# Altium project Sayma_RTM.PrjPcb (part 4 of 11)

## Sheet PWR_SEPIC_P12V_N12V.SchDoc: Sayma RTM
size 420 x 297 mm; $$Internal___BlkDate: 23:43:25_12-13-18; $$Internal_NAME_PLACEHOLDER: a3sheet; $$Internal_Resolution: 00001mm; $$NotCommonProperty_@NAME: PWR_SEPIC_P12V_N12V; $$NotCommonProperty_@PRINTORDER: 6; $$NotCommonProperty_@SHEET: 1; $$NotCommonProperty_@SHEETTOTAL: 1; CmpIndex: 12; Drawing Author: G.Kasprowicz; Drawing Number: Sayma RTM; Drawing Project: 8 channel SAWG; Drawing Revision: 2.0; SymIndex: 2227; Author: G.Kasprowicz; CompanyName: WUT ISE; DrawnBy: G.Kasprowicz; Organization: WUT ISE; Address1: PW ISE; Address2: Nowowiejska 15/19 00-665 Warsaw; Address3: gkasprow@gmail.com; DocumentNumber: 16; Revision: 1.0; SheetNumber: 16; SheetTotal: 18; ModifiedBy: -; CheckedDate: -; Title2: +/- 12V SEPIC; DivGrp: WUT ISE; Designer: G.Kasprowicz; ModifiedDate: -; ProjectName: Sensor Box
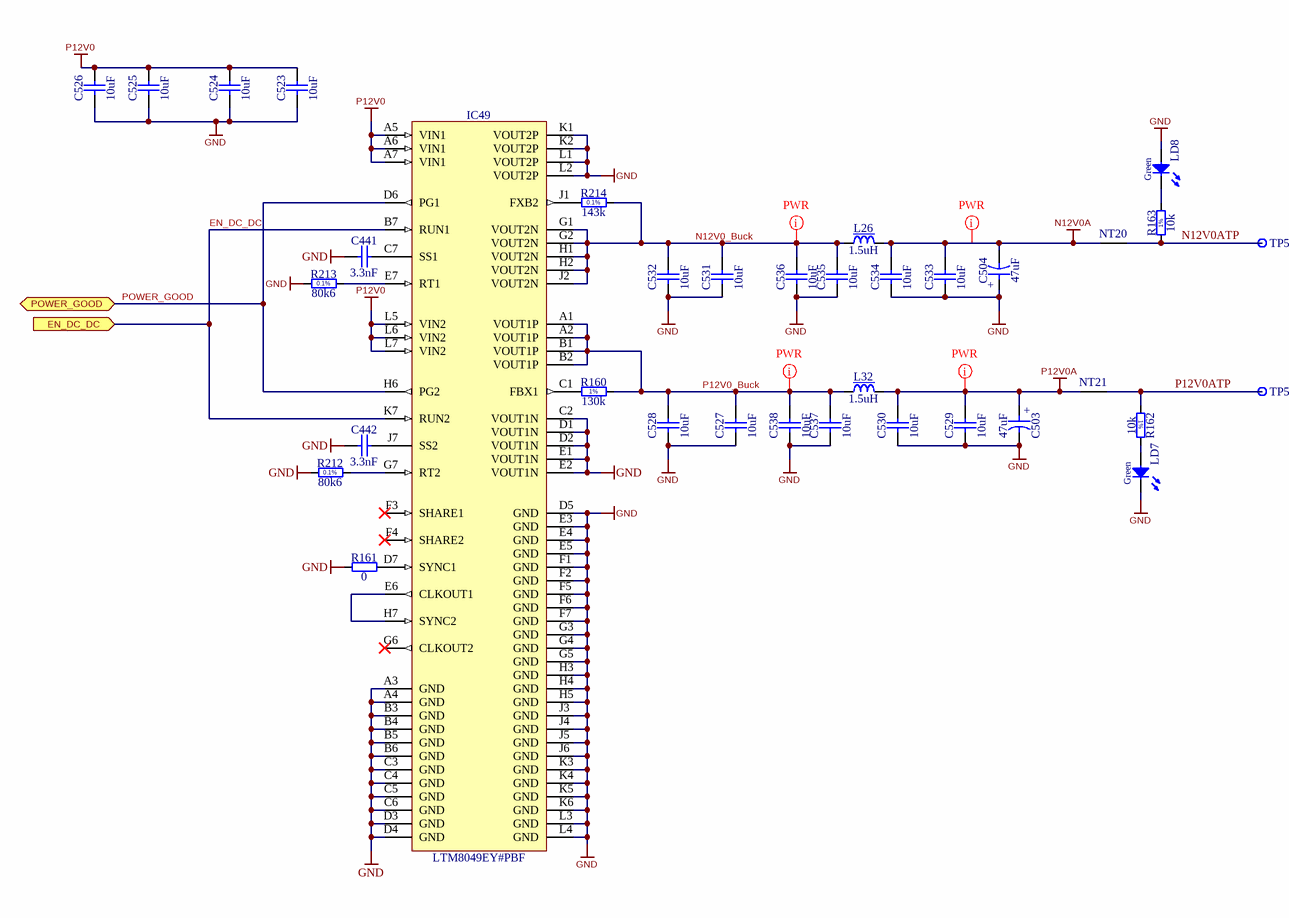
[diagram p5: PWR_SEPIC_P12V_N12V.SchDoc]

### Parts
C441  3.3nF  [CAPC1005X55N]
C442  3.3nF  [CAPC1005X55N]
C503  47uF  [CAPMP6032X280N]
C504  47uF  [CAPMP6032X280N]
C523  10uF  [CAPC2012X95N]
C524  10uF  [CAPC2012X95N]
C525  10uF  [CAPC2012X95N]
C526  10uF  [CAPC2012X95N]
C527  10uF  [CAPC2012X95N]
C528  10uF  [CAPC2012X95N]
C529  10uF  [CAPC2012X95N]
C530  10uF  [CAPC2012X95N]
C531  10uF  [CAPC2012X95N]
C532  10uF  [CAPC2012X95N]
C533  10uF  [CAPC2012X95N]
C534  10uF  [CAPC2012X95N]
C535  10uF  [CAPC2012X95N]
C536  10uF  [CAPC2012X95N]
C537  10uF  [CAPC2012X95N]
C538  10uF  [CAPC2012X95N]
IC49  LTM8049EY#PBF  [BGA77C127P7X11_900X1500X262]
L26  1.5uH  [IND_TDK_SPM6530]
L32  1.5uH  [IND_TDK_SPM6530]
LD7  Green  [LED_KINGBRIGHT_KPH-1608CGCK]
LD8  Green  [LED_KINGBRIGHT_KPH-1608CGCK]
NT20  Net Tie  [Net Tie]  (value not drawn)  (net tie, no BOM)
NT21  Net Tie  [Net Tie]  (value not drawn)  (net tie, no BOM)
R160  130k  [RESC1005X40N]
R161  0  [RESC1005X40N]
R162  10k  [RESC1005X40N]
R163  10k  [RESC1005X40N]
R212  80k6  [RESC1608X55N]
R213  80k6  [RESC1608X55N]
R214  143k  [RESC1608X55N]
TP55  Test Point  [TPS127]  (value not drawn)
TP56  Test Point  [TPS127]  (value not drawn)

### Ports
EN_DC_DC (in), POWER_GOOD (bidir)

### Nets
GND: C441.1 C442.1 C503.2 C504.1 C523.1 C524.1 C525.1 C526.1 C527.1 C528.1 C529.1 C530.1 C531.1 C532.1 C533.1 C534.1 C535.1 C536.1 C537.1 C538.1 IC49.A3(GND) IC49.A4(GND) IC49.B3(GND) IC49.B4(GND) IC49.B5(GND) IC49.B6(GND) IC49.C2(VOUT1N) IC49.C3(GND) IC49.C4(GND) IC49.C5(GND) IC49.C6(GND) IC49.D1(VOUT1N) IC49.D2(VOUT1N) IC49.D3(GND) IC49.D4(GND) IC49.D5(GND) IC49.E1(VOUT1N) IC49.E2(VOUT1N) IC49.E3(GND) IC49.E4(GND) IC49.E5(GND) IC49.F1(GND) IC49.F2(GND) IC49.F5(GND) IC49.F6(GND) IC49.F7(GND) IC49.G3(GND) IC49.G4(GND) IC49.G5(GND) IC49.H3(GND) IC49.H4(GND) IC49.H5(GND) IC49.J3(GND) IC49.J4(GND) IC49.J5(GND) IC49.J6(GND) IC49.K1(VOUT2P) IC49.K2(VOUT2P) IC49.K3(GND) IC49.K4(GND) IC49.K5(GND) IC49.K6(GND) IC49.L1(VOUT2P) IC49.L2(VOUT2P) IC49.L3(GND) IC49.L4(GND) LD7.1(C) LD8.2(A) R161.1 R212.1 R213.1
N12V0A: C504.2 C533.2 C534.2 L26.2 NT20.1
P12V0: C523.2 C524.2 C525.2 C526.2 IC49.A5(VIN1) IC49.A6(VIN1) IC49.A7(VIN1) IC49.L5(VIN2) IC49.L6(VIN2) IC49.L7(VIN2)
P12V0A: C503.1 C529.2 C530.2 L32.2 NT21.1
EN_DC_DC: IC49.B7(RUN1) IC49.K7(RUN2) ; port EN_DC_DC  [project net EN]
N12V0_Buck: C531.2 C532.2 C535.2 C536.2 IC49.G1(VOUT2N) IC49.G2(VOUT2N) IC49.H1(VOUT2N) IC49.H2(VOUT2N) IC49.J2(VOUT2N) L26.1 R214.2
N12V0ATP: NT20.2 R163.1 TP55.1
P12V0_Buck: C527.2 C528.2 C537.2 C538.2 IC49.A1(VOUT1P) IC49.A2(VOUT1P) IC49.B1(VOUT1P) IC49.B2(VOUT1P) L32.1 R160.2
P12V0ATP: NT21.2 R162.1 TP56.1
POWER_GOOD: IC49.D6(PG1) IC49.H6(PG2) ; port POWER_GOOD  [project net PGOOD]
NetC441_2: C441.2 IC49.C7(SS1)
NetC442_2: C442.2 IC49.J7(SS2)
NetIC49_C1: IC49.C1(FBX1) R160.1
NetIC49_D7: IC49.D7(SYNC1) R161.2
NetIC49_E6: IC49.E6(CLKOUT1) IC49.H7(SYNC2)
NetIC49_E7: IC49.E7(RT1) R213.2
NetIC49_G7: IC49.G7(RT2) R212.2
NetIC49_J1: IC49.J1(FXB2) R214.1
NetLD7_2: LD7.2(A) R162.2
NetLD8_1: LD8.1(C) R163.2

Not connected (* = marked no-connect by the designer): IC49 F3(SHARE1)* F4(SHARE2)* G6(CLKOUT2)*

### Layout directives
net class PWR: N12V0_Buck, N12V0A, P12V0_Buck, P12V0A

### Notes on the sheet
- Project/Equipment
- Document
- Designer
- Drawn by
- Check.by
- Copyright WUT ISE 2018.
  This documentation describes Open Hardware and is licensed under the CERN OHL v.1.1. You may redistribute and modify this documentation under the terms of the CERN OHL v.1.1. (http://ohwr.org/CERNOHL). This documentation is distributed WITHOUT ANY EXPRESS OR IMPLIED WARRANTY, INCLUDING OF MERCHANTABILITY, SATISFACTORY QUALITY AND FITNESS FOR A PARTICULAR PURPOSE. Please see the CERN OHL v.1.1 for applicable conditions.
- Contact
- File
- Last Mod.
- Print Date
- Sheet
- Size
- A3
- of
- Rev
- (in symbol CTE6032-28_47UF_16V_10%_LESR0350) +
- (in symbol R0402_10K_1%_0.0625W_100PPM) 1%
- (in symbol R0402_130K_1%_0.0625W_100PPM) 1%
- (in symbol R0603_80K6_0.1%_0.063W_10PPM) 0.1%
- (in symbol R0603_143K_0.1%_0.063W_10PPM) 0.1%

### Library data of the parts
C441 C442 = CC0402_3.3NF_50V_10%_X7R: Non-polarised capacitor; Manufacturer: GENERIC; Manufacturer1 Part Number: 223858715629; Part Description: SMD Multilayer Chip Ceramic Capacitor; TC: X7R; Tolerance: ±10%; Voltage: 50V; Case: 0402; Manufacturer Part Number: CC0402_3.3NF_50V_10%_X7R; Manufacturer1 Example: PHYCOMP; Part Number: CC0402_3.3NF_50V_10%_X7R; Pin Count: 2; SMD: Yes; Status: Not Recommended; Value: 3.3nF; Component Kind: Standard; Component Type: Standard; Mounted: Yes; Socket: No; Sense: No; Manufacturer1 ComponentHeight: 0.55mm; HelpURL: \\cern.ch\dfs\Applications\Altium\Datasheets\CC0402_X7R_PHYCOMP.pdf; Author: CERN DEM JLC; CreateDate: 03.12.2007; LatestRevisionDate: 03.12.2007
C503 C504 = CTE6032-28_47UF_16V_10%_LESR0350: as C488 on sheet DAC_JESD204B; Case: C; Manufacturer Part Number: CTE6032-28_47UF_16V_10%_LESR0350; Manufacturer1 Example: AVX; Part Number: CTE6032-28_47UF_16V_10%_LESR0350; Pin Count: 2; SMD: Yes; Value: 47uF; Component Kind: Standard; Component Type: Standard; Status: Preferred; Mounted: Yes; Socket: No; Sense: No; Manufacturer1 ComponentHeight: 2.8mm; HelpURL: \\cern.ch\dfs\Applications\Altium\Datasheets\CTE-LESR_AVX_TPS.pdf; Author: CERN DEM JLC; CreateDate: 05.05.2008; LatestRevisionDate: 20.01.2009
C523-C538 = CC0805_10UF_25V_10%_X5R: as C539 on sheet PWR_SEPIC_N6V; Case: 0805; Manufacturer Part Number: CC0805_10UF_25V_10%_X5R; Manufacturer1 Example: MURATA; Part Number: CC0805_10UF_25V_10%_X5R; Pin Count: 2; SMD: Yes; Status: Preferred; Value: 10uF; Component Kind: Standard; Component Type: Standard; Mounted: Yes; Socket: No; Sense: No; Manufacturer1 ComponentHeight: 0.95mm; HelpURL: \\cern.ch\dfs\Applications\Altium\Datasheets\CC0805_X5R_MURATA_GRM.pdf; Author: CERN DEM JLC; CreateDate: 25.10.2012; LatestRevisionDate: 06.09.2016
IC49 = LTM8049EY#PBF: as IC50 on sheet PWR_SEPIC_N6V; Part Number: LTM8049EY#PBF; Component Kind: Standard; Component Type: Standard; Device: LTM8049EY#PBF; PackageDescription: BGA, 1.27mm Pitch, Rect.; 77 Pin, 7 Columns X 11 Rows, 9.00mm X 15.00mm X 2.62mm H; Part Description: Dual SEPIC or Inverting uModule DC/DC Converter; Manufacturer Part Number: LTM8049EY#PBF; Pin Count: 77; Case: BGA77; Mounted: Yes; Socket: No; SMD: Yes; Sense: No; ComponentHeight: 2.62mm; HelpURL: \\cern.ch\dfs\Applications\Altium\Datasheets\LTM8049EY#PBF.pdf; Author: CERN DEM JLC; CreateDate: 08.12.2016; LatestRevisionDate: 08.12.2016
L26 L32 = IND_1.5UH_20%_TDK_SPM6530: as L25 on sheet PWR_SEPIC_N6V; ComponentHeight: 3mm; Part Number: IND_1.5UH_20%_TDK_SPM6530; Pin Count: 2; SMD: Yes; Value: 1.5uH; Component Kind: Standard; Component Type: Standard; Status: None; Mounted: Yes; Socket: No; Sense: No; HelpURL: \\cern.ch\dfs\Applications\Altium\Datasheets\IND_TDK_SPM6530.pdf; Author: CERN DEM MR; CreateDate: 08.11.2016; LatestRevisionDate: 08.11.2016
LD7 LD8 = LED_KINGBRIGHT_KPH-1608CGCK: as LD9 on sheet PWR_SEPIC_N6V; Author: CERN DEM JLC; Color: Green; Component Kind: Standard; Component Type: Standard; ComponentHeight: 0.65mm; CreateDate: 03.07.2017; HelpURL: \\cern.ch\dfs\Applications\Altium\Datasheets\LED_KINGBRIGHT_KPH-1608CGCK.pdf; LatestRevisionDate: 03.07.2017; Manufacturer Part Number: KPH-1608CGCK; Manufacturer: KINGBRIGHT; Mounted: Yes; PackageDescription: SMT Green LED, Case 0603, Body L 1.6 x W 0.8mm H 0.65mm; Part Number: LED_KINGBRIGHT_KPH-1608CGCK; Pin Count: 2; Sense: No; SMD: Yes; Socket: No
NT20 NT21 = Net Tie: as NT18 on sheet PWR_SEPIC_N6V; Part Number: Net Tie; Component Type: Net Tie; Pin Count: 2; Family: Net Tie; Socket: No; SMD: No; Sense: No; Status: None; ComponentHeight: 0mm; HelpURL: Undefined; Author: CERN DEM JLC; CreateDate: 22.03.2011; LatestRevisionDate: 22.03.2011; PackageDescription: 2 Plated Through Hole For Coaxial Cable Link: Hole Dia.=1.4mm Pad Dia.=2.5mm
R160 = R0402_130K_1%_0.0625W_100PPM: Resistor - 1%; Manufacturer: GENERIC; Manufacturer1 Part Number: 232270671304L; Part Description: General Purpose Thick Film Chip Resistor; TC: ±100ppm/°C; PressFit: No; Case: 0402; Manufacturer Part Number: R0402_130K_1%_0.0625W_100PPM; Manufacturer1 ComponentHeight: 0.4mm; Manufacturer1 Example: YAGEO PHYCOMP; Part Number: R0402_130K_1%_0.0625W_100PPM; Pin Count: 2; Power: 0.0625W; Sense: No; SMD: Yes; Status: Not Recommended; Tolerance: ±1%; Value: 130k; Component Kind: Standard; Component Type: Standard; Mounted: Yes; Socket: No; HelpURL: \\cern.ch\dfs\Applications\Altium\Datasheets\R0402_Phycomp_RC0402.pdf; Author: CERN DEM JLC; CreateDate: 03.12.2007; LatestRevisionDate: 17.10.2012
R161 = R0402_0R_JUMPER: as R30 on sheet DAC_JESD204B; Case: 0402; Manufacturer Part Number: R0402_0R_JUMPER; Manufacturer1 ComponentHeight: 0.4mm; Manufacturer1 Example: YAGEO PHYCOMP; Part Number: R0402_0R_JUMPER; Pin Count: 2; Sense: No; SMD: Yes; Status: Not Recommended; Value: 0; Component Kind: Standard; Component Type: Standard; Mounted: Yes; Socket: No; HelpURL: \\cern.ch\dfs\Applications\Altium\Datasheets\R0402_Phycomp_RC0402.pdf; Author: CERN DEM JLC; CreateDate: 03.12.2007; LatestRevisionDate: 17.10.2012
R162 R163 = R0402_10K_1%_0.0625W_100PPM: as R90 on sheet RTM_POWER_SUPPLY; Case: 0402; Manufacturer Part Number: R0402_10K_1%_0.0625W_100PPM; Manufacturer1 ComponentHeight: 0.4mm; Manufacturer1 Example: YAGEO PHYCOMP; Part Number: R0402_10K_1%_0.0625W_100PPM; Pin Count: 2; Power: 0.0625W; Sense: No; SMD: Yes; Status: Not Recommended; Tolerance: ±1%; Value: 10k; Component Kind: Standard; Component Type: Standard; Mounted: Yes; Socket: No; HelpURL: \\cern.ch\dfs\Applications\Altium\Datasheets\R0402_Phycomp_RC0402.pdf; Author: CERN DEM JLC; CreateDate: 03.12.2007; LatestRevisionDate: 17.10.2012
R212 R213 = R0603_80K6_0.1%_0.063W_10PPM: as R215 on sheet PWR_SEPIC_N6V; Case: 0603; Manufacturer Part Number: R0603_80K6_0.1%_0.063W_10PPM; Manufacturer1 ComponentHeight: 0.5mm; Manufacturer1 Example: TYCO HOLSWORTHY; Part Number: R0603_80K6_0.1%_0.063W_10PPM; Pin Count: 2; Sense: No; SMD: Yes; Status: Not Recommended; Tolerance: ±0.1%; Value: 80k6; Component Kind: Standard; Component Type: Standard; Mounted: Yes; Socket: No; HelpURL: \\cern.ch\dfs\Applications\Altium\Datasheets\R0603_Tyco_RN73.pdf; Author: CERN DEM JLC; CreateDate: 03.12.2007; LatestRevisionDate: 13.03.2008
R214 = R0603_143K_0.1%_0.063W_10PPM: Resistor - 0.1%; Manufacturer: GENERIC; Manufacturer1 Part Number: RN73C1J143KBTDF; Part Description: Thin Film Chip Resistor; Power: 0.063W; TC: ±10ppm; PressFit: No; Case: 0603; Manufacturer Part Number: R0603_143K_0.1%_0.063W_10PPM; Manufacturer1 ComponentHeight: 0.5mm; Manufacturer1 Example: TYCO HOLSWORTHY; Part Number: R0603_143K_0.1%_0.063W_10PPM; Pin Count: 2; Sense: No; SMD: Yes; Status: Not Recommended; Tolerance: ±0.1%; Value: 143k; Component Kind: Standard; Component Type: Standard; Mounted: Yes; Socket: No; HelpURL: \\cern.ch\dfs\Applications\Altium\Datasheets\R0603_Tyco_RN73.pdf; Author: CERN DEM JLC; CreateDate: 03.12.2007; LatestRevisionDate: 13.03.2008
TP55 TP56 = SMD_PAD_1.27X1.27MM: as TP63 on sheet DAC_JESD204B; ComponentHeight: 0mm; Family: Test Point; Part Number: SMD_PAD_1.27X1.27MM; Pin Count: 1; Sense: No; SMD: Yes; Socket: No; Status: None; Component Kind: Standard (No BOM); Component Type: Standard (No BOM); HelpURL: Undefined; Author: CERN DEM JLC; CreateDate: 12.01.2008; LatestRevisionDate: 12.01.2008; PackageDescription: 1.27mm x 1.27mm PCB Copper Area (SMD Test Point)

## Sheet PWR_Buck_2V_4V_4A.SchDoc: Sayma RTM
size 420 x 297 mm; $$Internal___BlkDate: 23:43:25_12-13-18; $$Internal_NAME_PLACEHOLDER: a3sheet; $$Internal_Resolution: 00001mm; $$NotCommonProperty_@NAME: PWR_Buck_2V_4V_4A; $$NotCommonProperty_@PRINTORDER: 3; $$NotCommonProperty_@SHEET: 1; $$NotCommonProperty_@SHEETTOTAL: 1; $$NotCommonProperty_FORWARD_PCB: 0; CmpIndex: 7; Drawing Author: G.Kasprowicz; Drawing Number: Sayma RTM; Drawing Project: 8 channel SAWG; Drawing Revision: 2.0; SymIndex: 2227; Author: G.Kasprowicz; CompanyName: WUT ISE; DrawnBy: G.Kasprowicz; Organization: WUT ISE; Address1: PW ISE; Address2: Nowowiejska 15/19 00-665 Warsaw; Address3: gkasprow@gmail.com; DocumentNumber: 12; Revision: 1.0; SheetNumber: 12; SheetTotal: 18; ModifiedBy: -; CheckedDate: -; Title2: +2V & +4V buck; DivGrp: WUT ISE; Designer: G.Kasprowicz; ModifiedDate: -; ProjectName: Sensor Box
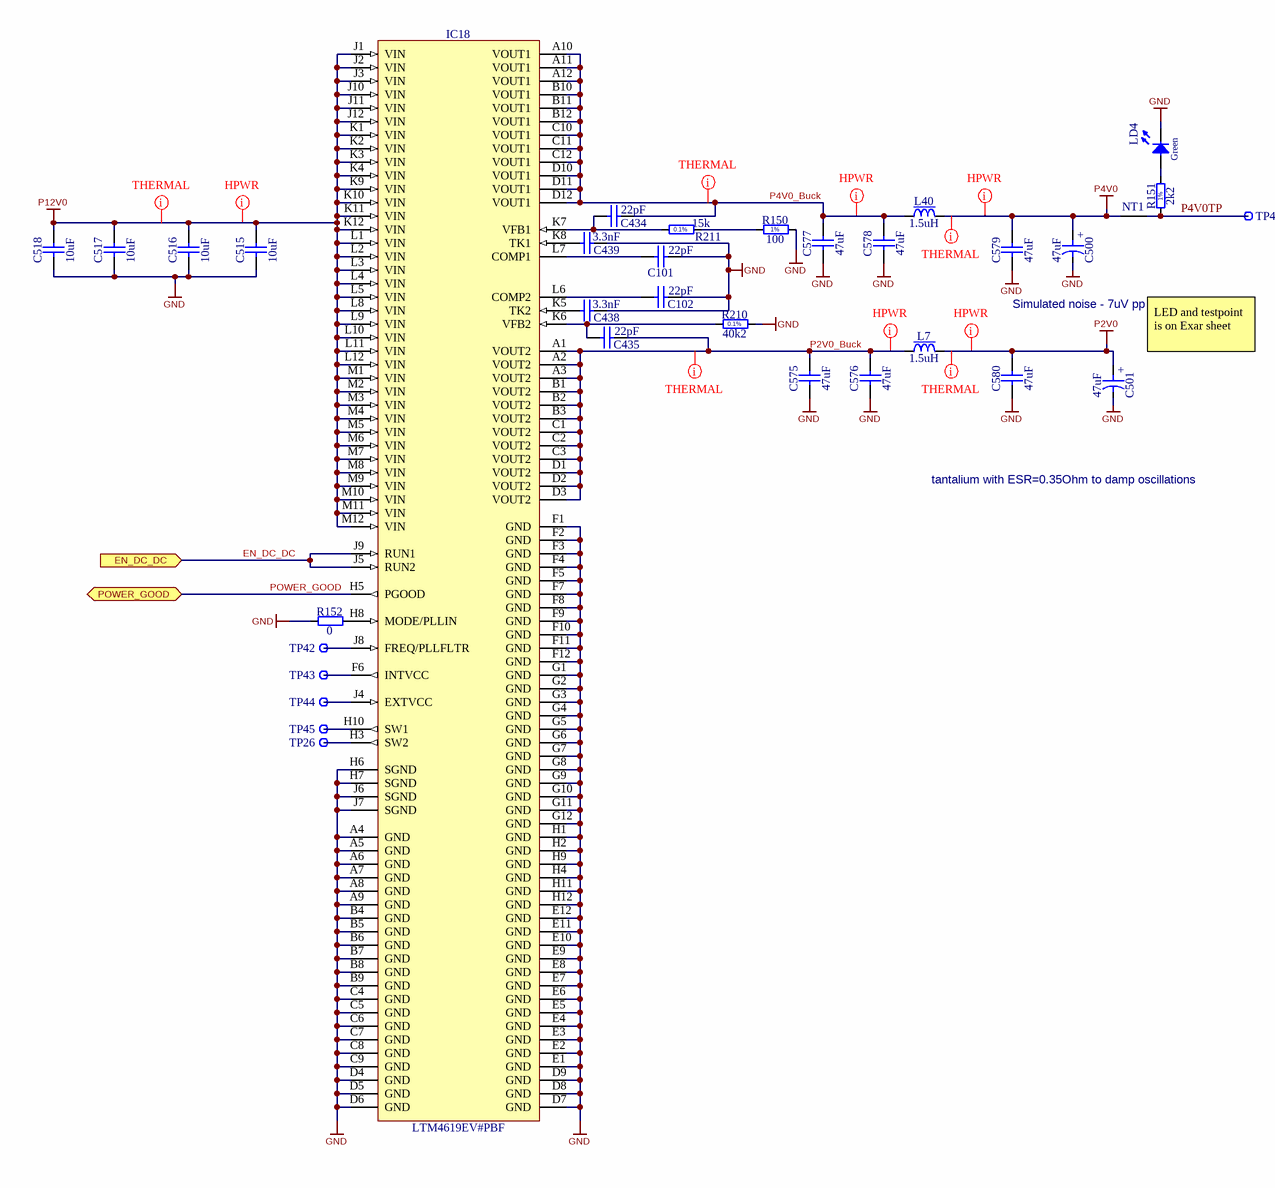
[diagram p6: PWR_Buck_2V_4V_4A.SchDoc]

### Parts
C101  22pF  [CAPC1005X55N]
C102  22pF  [CAPC1005X55N]
C434  22pF  [CAPC1005X55N]
C435  22pF  [CAPC1005X55N]
C438  3.3nF  [CAPC1005X55N]
C439  3.3nF  [CAPC1005X55N]
C500  47uF  [CAPMP6032X280N]
C501  47uF  [CAPMP6032X280N]
C515  10uF  [CAPC2012X95N]
C516  10uF  [CAPC2012X95N]
C517  10uF  [CAPC2012X95N]
C518  10uF  [CAPC2012X95N]
C575  47uF  [CAPC3225X270N]
C576  47uF  [CAPC3225X270N]
C577  47uF  [CAPC3225X270N]
C578  47uF  [CAPC3225X270N]
C579  47uF  [CAPC3225X270N]
C580  47uF  [CAPC3225X270N]
IC18  LTM4619EV#PBF  [LGA144S127P12X12_1500X1500X292R]
L7  1.5uH  [IND_TDK_SPM6530]
L40  1.5uH  [IND_TDK_SPM6530]
LD4  Green  [LED_KINGBRIGHT_KPH-1608CGCK]
NT1  Net Tie  [Net Tie]  (value not drawn)  (net tie, no BOM)
R150  100  [RESC1005X40N]
R151  2k2  [RESC1005X40N]
R152  0  [RESC1005X40N]
R210  40k2  [RESC1608X55N]
R211  15k  [RESC1608X55N]
TP26  Test Point  [TPS127]  (value not drawn)
TP41  Test Point  [TPS127]  (value not drawn)
TP42  Test Point  [TPS127]  (value not drawn)
TP43  Test Point  [TPS127]  (value not drawn)
TP44  Test Point  [TPS127]  (value not drawn)
TP45  Test Point  [TPS127]  (value not drawn)

### Ports
EN_DC_DC (in), POWER_GOOD (bidir)

### Nets
GND: C101.1 C102.1 C438.2 C439.2 C500.2 C501.2 C515.1 C516.1 C517.1 C518.1 C575.1 C576.1 C577.1 C578.1 C579.1 C580.1 IC18.A4(GND) IC18.A5(GND) IC18.A6(GND) IC18.A7(GND) IC18.A8(GND) IC18.A9(GND) IC18.B4(GND) IC18.B5(GND) IC18.B6(GND) IC18.B7(GND) IC18.B8(GND) IC18.B9(GND) IC18.C4(GND) IC18.C5(GND) IC18.C6(GND) IC18.C7(GND) IC18.C8(GND) IC18.C9(GND) IC18.D4(GND) IC18.D5(GND) IC18.D6(GND) IC18.D7(GND) IC18.D8(GND) IC18.D9(GND) IC18.E1(GND) IC18.E2(GND) IC18.E3(GND) IC18.E4(GND) IC18.E5(GND) IC18.E6(GND) IC18.E7(GND) IC18.E8(GND) IC18.E9(GND) IC18.E10(GND) IC18.E11(GND) IC18.E12(GND) IC18.F1(GND) IC18.F2(GND) IC18.F3(GND) IC18.F4(GND) IC18.F5(GND) IC18.F7(GND) IC18.F8(GND) IC18.F9(GND) IC18.F10(GND) IC18.F11(GND) IC18.F12(GND) IC18.G1(GND) IC18.G2(GND) IC18.G3(GND) IC18.G4(GND) IC18.G5(GND) IC18.G6(GND) IC18.G7(GND) IC18.G8(GND) IC18.G9(GND) IC18.G10(GND) IC18.G11(GND) IC18.G12(GND) IC18.H1(GND) IC18.H2(GND) IC18.H4(GND) IC18.H6(SGND) IC18.H7(SGND) IC18.H9(GND) IC18.H11(GND) IC18.H12(GND) IC18.J6(SGND) IC18.J7(SGND) LD4.1(C) R150.2 R152.1 R210.2
P2V0: C501.1 C580.2 L7.2
P4V0: C500.1 C579.2 L40.2 NT1.1
P12V0: C515.2 C516.2 C517.2 C518.2 IC18.J1(VIN) IC18.J2(VIN) IC18.J3(VIN) IC18.J10(VIN) IC18.J11(VIN) IC18.J12(VIN) IC18.K1(VIN) IC18.K2(VIN) IC18.K3(VIN) IC18.K4(VIN) IC18.K9(VIN) IC18.K10(VIN) IC18.K11(VIN) IC18.K12(VIN) IC18.L1(VIN) IC18.L2(VIN) IC18.L3(VIN) IC18.L4(VIN) IC18.L5(VIN) IC18.L8(VIN) IC18.L9(VIN) IC18.L10(VIN) IC18.L11(VIN) IC18.L12(VIN) IC18.M1(VIN) IC18.M2(VIN) IC18.M3(VIN) IC18.M4(VIN) IC18.M5(VIN) IC18.M6(VIN) IC18.M7(VIN) IC18.M8(VIN) IC18.M9(VIN) IC18.M10(VIN) IC18.M11(VIN) IC18.M12(VIN)
EN_DC_DC: IC18.J5(RUN2) IC18.J9(RUN1) ; port EN_DC_DC  [project net EN]
P2V0_Buck: C435.1 C575.2 C576.2 IC18.A1(VOUT2) IC18.A2(VOUT2) IC18.A3(VOUT2) IC18.B1(VOUT2) IC18.B2(VOUT2) IC18.B3(VOUT2) IC18.C1(VOUT2) IC18.C2(VOUT2) IC18.C3(VOUT2) IC18.D1(VOUT2) IC18.D2(VOUT2) IC18.D3(VOUT2) L7.1
P4V0_Buck: C434.1 C577.2 C578.2 IC18.A10(VOUT1) IC18.A11(VOUT1) IC18.A12(VOUT1) IC18.B10(VOUT1) IC18.B11(VOUT1) IC18.B12(VOUT1) IC18.C10(VOUT1) IC18.C11(VOUT1) IC18.C12(VOUT1) IC18.D10(VOUT1) IC18.D11(VOUT1) IC18.D12(VOUT1) L40.1
P4V0TP: NT1.2 R151.1 TP41.1
POWER_GOOD: IC18.H5(PGOOD) ; port POWER_GOOD  [project net PGOOD]
NetC101_2: C101.2 IC18.L7(COMP1)
NetC102_2: C102.2 IC18.L6(COMP2)
NetC434_2: C434.2 IC18.K7(VFB1) R211.1
NetC435_2: C435.2 IC18.K6(VFB2) R210.1
NetC438_1: C438.1 IC18.K5(TK2)
NetC439_1: C439.1 IC18.K8(TK1)
NetIC18_F6: IC18.F6(INTVCC) TP43.1
NetIC18_H3: IC18.H3(SW2) TP26.1
NetIC18_H8: IC18.H8(MODE/PLLIN) R152.2
NetIC18_H10: IC18.H10(SW1) TP45.1
NetIC18_J4: IC18.J4(EXTVCC) TP44.1
NetIC18_J8: IC18.J8(FREQ/PLLFLTR) TP42.1
NetLD4_2: LD4.2(A) R151.2
NetR150_1: R150.1 R211.2

### Layout directives
net class HPWR: P2V0, P2V0_Buck, P4V0, P4V0_Buck, P12V0
net class THERMAL: P2V0, P2V0_Buck, P4V0, P4V0_Buck, P12V0

### Notes on the sheet
- Simulated noise - 7uV pp
- (near C501) LED and testpoint is on Exar sheet
- tantalium with ESR=0.35Ohm to damp oscillations
- Project/Equipment
- Document
- Designer
- Drawn by
- Check.by
- Copyright WUT ISE 2018.
  This documentation describes Open Hardware and is licensed under the CERN OHL v.1.1. You may redistribute and modify this documentation under the terms of the CERN OHL v.1.1. (http://ohwr.org/CERNOHL). This documentation is distributed WITHOUT ANY EXPRESS OR IMPLIED WARRANTY, INCLUDING OF MERCHANTABILITY, SATISFACTORY QUALITY AND FITNESS FOR A PARTICULAR PURPOSE. Please see the CERN OHL v.1.1 for applicable conditions.
- Contact
- File
- Last Mod.
- Print Date
- Sheet
- Size
- A3
- of
- Rev
- (in symbol CTE6032-28_47UF_16V_10%_LESR0350) +
- (in symbol R0402_2K2_1%_0.0625W_100PPM) 1%
- (in symbol R0402_100R_1%_0.0625W_100PPM) 1%
- (in symbol R0603_15K_0.1%_0.063W_10PPM) 0.1%
- (in symbol R0603_40K2_0.1%_0.063W_10PPM) 0.1%

### Library data of the parts
C101 C102 C434 C435 = CC0402_22PF_50V_5%_C0G: Non-polarised capacitor; Manufacturer: GENERIC; Manufacturer1 Part Number: C0402C220J5GACTU; Part Description: SMD Multilayer Chip Ceramic Capacitor; TC: C0G/NP0; Tolerance: ±5%; Voltage: 50V; Case: 0402; Manufacturer Part Number: CC0402_22PF_50V_5%_C0G; Manufacturer1 Example: KEMET; Part Number: CC0402_22PF_50V_5%_C0G; Pin Count: 2; SMD: Yes; Status: Preferred; Value: 22pF; Component Kind: Standard; Component Type: Standard; Mounted: Yes; Socket: No; Sense: No; Manufacturer1 ComponentHeight: 0.55mm; HelpURL: \\cern.ch\dfs\Applications\Altium\Datasheets\CC0805_C0G_KEMET_(Commercial Grade).pdf; Author: CERN DEM JLC; CreateDate: 03.12.2007; LatestRevisionDate: 03.12.2007
C438 C439 = CC0402_3.3NF_50V_10%_X7R: as C441 on sheet PWR_SEPIC_P12V_N12V; Case: 0402; Manufacturer Part Number: CC0402_3.3NF_50V_10%_X7R; Manufacturer1 Example: PHYCOMP; Part Number: CC0402_3.3NF_50V_10%_X7R; Pin Count: 2; SMD: Yes; Status: Not Recommended; Value: 3.3nF; Component Kind: Standard; Component Type: Standard; Mounted: Yes; Socket: No; Sense: No; Manufacturer1 ComponentHeight: 0.55mm; HelpURL: \\cern.ch\dfs\Applications\Altium\Datasheets\CC0402_X7R_PHYCOMP.pdf; Author: CERN DEM JLC; CreateDate: 03.12.2007; LatestRevisionDate: 03.12.2007
C500 C501 = CTE6032-28_47UF_16V_10%_LESR0350: as C488 on sheet DAC_JESD204B; Case: C; Manufacturer Part Number: CTE6032-28_47UF_16V_10%_LESR0350; Manufacturer1 Example: AVX; Part Number: CTE6032-28_47UF_16V_10%_LESR0350; Pin Count: 2; SMD: Yes; Value: 47uF; Component Kind: Standard; Component Type: Standard; Status: Preferred; Mounted: Yes; Socket: No; Sense: No; Manufacturer1 ComponentHeight: 2.8mm; HelpURL: \\cern.ch\dfs\Applications\Altium\Datasheets\CTE-LESR_AVX_TPS.pdf; Author: CERN DEM JLC; CreateDate: 05.05.2008; LatestRevisionDate: 20.01.2009
C515-C518 = CC0805_10UF_25V_10%_X5R: as C539 on sheet PWR_SEPIC_N6V; Case: 0805; Manufacturer Part Number: CC0805_10UF_25V_10%_X5R; Manufacturer1 Example: MURATA; Part Number: CC0805_10UF_25V_10%_X5R; Pin Count: 2; SMD: Yes; Status: Preferred; Value: 10uF; Component Kind: Standard; Component Type: Standard; Mounted: Yes; Socket: No; Sense: No; Manufacturer1 ComponentHeight: 0.95mm; HelpURL: \\cern.ch\dfs\Applications\Altium\Datasheets\CC0805_X5R_MURATA_GRM.pdf; Author: CERN DEM JLC; CreateDate: 25.10.2012; LatestRevisionDate: 06.09.2016
C575-C580 = CC1210_47UF_10V_10%_X7R: as C584 on sheet PWR_SEPIC_N6V; Case: 1210; Manufacturer Part Number: CC1210_47UF_10V_10%_X7R; Manufacturer1 Example: MURATA; Part Number: CC1210_47UF_10V_10%_X7R; Pin Count: 2; SMD: Yes; Status: None; Value: 47uF; Component Kind: Standard; Component Type: Standard; Mounted: Yes; Socket: No; Sense: No; Manufacturer1 ComponentHeight: 2.7mm; HelpURL: \\cern.ch\dfs\Applications\Altium\Datasheets\CC1210_X7R_MURATA.pdf; Author: CERN DEM BC; CreateDate: 18.11.2015; LatestRevisionDate: 18.11.2015
IC18 = LTM4619EV#PBF: 4.5V-26.5V To 0.8V-5V, Iout 4A Dual DC/DC uModule Regulator; Manufacturer: LINEAR TECHNOLOGY; Part Description: 4.5V-26.5V To 0.8V-5V, Iout 4A Dual DC-DC uModule Regulator; Bonding: No; PressFit: No; Case: LGA144; ComponentHeight: 2.92mm; Device: LTM4619EV#PBF; Manufacturer Part Number: LTM4619EV#PBF; Mounted: Yes; PackageDescription: LGA,1.27mm pitch,square;144 pin,12 columns X 12 rows,15.00mm X 15.00mm X 2.92mm H (w/reversed pins); Part Number: LTM4619EV#PBF; Pin Count: 144; Sense: No; SMD: Yes; Socket: No; Component Kind: Standard; Component Type: Standard; HelpURL: \\cern.ch\dfs\Applications\Altium\Datasheets\LTM4619EV#PBF.pdf; Author: CERN DEM JLC; CreateDate: 06.05.2010; LatestRevisionDate: 07.12.2011
L7 L40 = IND_1.5UH_20%_TDK_SPM6530: as L25 on sheet PWR_SEPIC_N6V; ComponentHeight: 3mm; Part Number: IND_1.5UH_20%_TDK_SPM6530; Pin Count: 2; SMD: Yes; Value: 1.5uH; Component Kind: Standard; Component Type: Standard; Status: None; Mounted: Yes; Socket: No; Sense: No; HelpURL: \\cern.ch\dfs\Applications\Altium\Datasheets\IND_TDK_SPM6530.pdf; Author: CERN DEM MR; CreateDate: 08.11.2016; LatestRevisionDate: 08.11.2016
LD4 = LED_KINGBRIGHT_KPH-1608CGCK: as LD9 on sheet PWR_SEPIC_N6V; Author: CERN DEM JLC; Color: Green; Component Kind: Standard; Component Type: Standard; ComponentHeight: 0.65mm; CreateDate: 03.07.2017; HelpURL: \\cern.ch\dfs\Applications\Altium\Datasheets\LED_KINGBRIGHT_KPH-1608CGCK.pdf; LatestRevisionDate: 03.07.2017; Manufacturer Part Number: KPH-1608CGCK; Manufacturer: KINGBRIGHT; Mounted: Yes; PackageDescription: SMT Green LED, Case 0603, Body L 1.6 x W 0.8mm H 0.65mm; Part Number: LED_KINGBRIGHT_KPH-1608CGCK; Pin Count: 2; Sense: No; SMD: Yes; Socket: No
NT1 = Net Tie: as NT18 on sheet PWR_SEPIC_N6V; Part Number: Net Tie; Component Type: Net Tie; Pin Count: 2; Family: Net Tie; Socket: No; SMD: No; Sense: No; Status: None; ComponentHeight: 0mm; HelpURL: Undefined; Author: CERN DEM JLC; CreateDate: 22.03.2011; LatestRevisionDate: 22.03.2011; PackageDescription: 2 Plated Through Hole For Coaxial Cable Link: Hole Dia.=1.4mm Pad Dia.=2.5mm
R150 = R0402_100R_1%_0.0625W_100PPM: Resistor - 1%; Manufacturer: GENERIC; Manufacturer1 Part Number: 232270671001L; Part Description: General Purpose Thick Film Chip Resistor; TC: ±100ppm/°C; PressFit: No; Case: 0402; Manufacturer Part Number: R0402_100R_1%_0.0625W_100PPM; Manufacturer1 ComponentHeight: 0.4mm; Manufacturer1 Example: YAGEO PHYCOMP; Part Number: R0402_100R_1%_0.0625W_100PPM; Pin Count: 2; Power: 0.0625W; Sense: No; SMD: Yes; Status: Not Recommended; Tolerance: ±1%; Value: 100; Component Kind: Standard; Component Type: Standard; Mounted: Yes; Socket: No; HelpURL: \\cern.ch\dfs\Applications\Altium\Datasheets\R0402_Phycomp_RC0402.pdf; Author: CERN DEM JLC; CreateDate: 03.12.2007; LatestRevisionDate: 17.10.2012
R151 = R0402_2K2_1%_0.0625W_100PPM: Resistor - 1%; Manufacturer: GENERIC; Manufacturer1 Part Number: 232270672202L; Part Description: General Purpose Thick Film Chip Resistor; TC: ±100ppm/°C; PressFit: No; Case: 0402; Manufacturer Part Number: R0402_2K2_1%_0.0625W_100PPM; Manufacturer1 ComponentHeight: 0.4mm; Manufacturer1 Example: YAGEO PHYCOMP; Part Number: R0402_2K2_1%_0.0625W_100PPM; Pin Count: 2; Power: 0.0625W; Sense: No; SMD: Yes; Status: Not Recommended; Tolerance: ±1%; Value: 2k2; Component Kind: Standard; Component Type: Standard; Mounted: Yes; Socket: No; HelpURL: \\cern.ch\dfs\Applications\Altium\Datasheets\R0402_Phycomp_RC0402.pdf; Author: CERN DEM JLC; CreateDate: 03.12.2007; LatestRevisionDate: 17.10.2012
R152 = R0402_0R_JUMPER: as R30 on sheet DAC_JESD204B; Case: 0402; Manufacturer Part Number: R0402_0R_JUMPER; Manufacturer1 ComponentHeight: 0.4mm; Manufacturer1 Example: YAGEO PHYCOMP; Part Number: R0402_0R_JUMPER; Pin Count: 2; Sense: No; SMD: Yes; Status: Not Recommended; Value: 0; Component Kind: Standard; Component Type: Standard; Mounted: Yes; Socket: No; HelpURL: \\cern.ch\dfs\Applications\Altium\Datasheets\R0402_Phycomp_RC0402.pdf; Author: CERN DEM JLC; CreateDate: 03.12.2007; LatestRevisionDate: 17.10.2012
R210 = R0603_40K2_0.1%_0.063W_10PPM: Resistor - 0.1%; Manufacturer: GENERIC; Manufacturer1 Part Number: RN73C1J40K2BTDF; Part Description: Thin Film Chip Resistor; Power: 0.063W; TC: ±10ppm; PressFit: No; Case: 0603; Manufacturer Part Number: R0603_40K2_0.1%_0.063W_10PPM; Manufacturer1 ComponentHeight: 0.5mm; Manufacturer1 Example: TYCO HOLSWORTHY; Part Number: R0603_40K2_0.1%_0.063W_10PPM; Pin Count: 2; Sense: No; SMD: Yes; Status: Not Recommended; Tolerance: ±0.1%; Value: 40k2; Component Kind: Standard; Component Type: Standard; Mounted: Yes; Socket: No; HelpURL: \\cern.ch\dfs\Applications\Altium\Datasheets\R0603_Tyco_RN73.pdf; Author: CERN DEM JLC; CreateDate: 03.12.2007; LatestRevisionDate: 13.03.2008
R211 = R0603_15K_0.1%_0.063W_10PPM: Resistor - 0.1%; Manufacturer: GENERIC; Manufacturer1 Part Number: RN73C1J15KBTDF; Part Description: Thin Film Chip Resistor; Power: 0.063W; TC: ±10ppm; PressFit: No; Case: 0603; Manufacturer Part Number: R0603_15K_0.1%_0.063W_10PPM; Manufacturer1 ComponentHeight: 0.5mm; Manufacturer1 Example: TYCO HOLSWORTHY; Part Number: R0603_15K_0.1%_0.063W_10PPM; Pin Count: 2; Sense: No; SMD: Yes; Status: Not Recommended; Tolerance: ±0.1%; Value: 15k; Component Kind: Standard; Component Type: Standard; Mounted: Yes; Socket: No; HelpURL: \\cern.ch\dfs\Applications\Altium\Datasheets\R0603_Tyco_RN73.pdf; Author: CERN DEM JLC; CreateDate: 03.12.2007; LatestRevisionDate: 13.03.2008
TP26 TP41-TP45 = SMD_PAD_1.27X1.27MM: as TP63 on sheet DAC_JESD204B; ComponentHeight: 0mm; Family: Test Point; Part Number: SMD_PAD_1.27X1.27MM; Pin Count: 1; Sense: No; SMD: Yes; Socket: No; Status: None; Component Kind: Standard (No BOM); Component Type: Standard (No BOM); HelpURL: Undefined; Author: CERN DEM JLC; CreateDate: 12.01.2008; LatestRevisionDate: 12.01.2008; PackageDescription: 1.27mm x 1.27mm PCB Copper Area (SMD Test Point)

## Sheet PWR_Buck_6V_8A.SchDoc: Sayma RTM
size 420 x 297 mm; $$Internal___BlkDate: 23:43:25_12-13-18; $$Internal_NAME_PLACEHOLDER: a3sheet; $$Internal_Resolution: 00001mm; $$NotCommonProperty_@NAME: PWR_Buck_6V_8A; $$NotCommonProperty_@PRINTORDER: 4; $$NotCommonProperty_@SHEET: 1; $$NotCommonProperty_@SHEETTOTAL: 1; $$NotCommonProperty_FORWARD_PCB: 0; CmpIndex: 6; Drawing Author: G.Kasprowicz; Drawing Number: Sayma RTM; Drawing Project: 8 channel SAWG; Drawing Revision: 2.0; SymIndex: 2227; Author: G.Kasprowicz; CompanyName: WUT ISE; DrawnBy: G.Kasprowicz; Organization: WUT ISE; Address1: PW ISE; Address2: Nowowiejska 15/19 00-665 Warsaw; Address3: gkasprow@gmail.com; DocumentNumber: 13; Revision: 1.0; SheetNumber: 13; SheetTotal: 18; ModifiedBy: -; CheckedDate: -; Title2: +6V buck; DivGrp: WUT ISE; Designer: G.Kasprowicz; ModifiedDate: -; ProjectName: Sensor Box
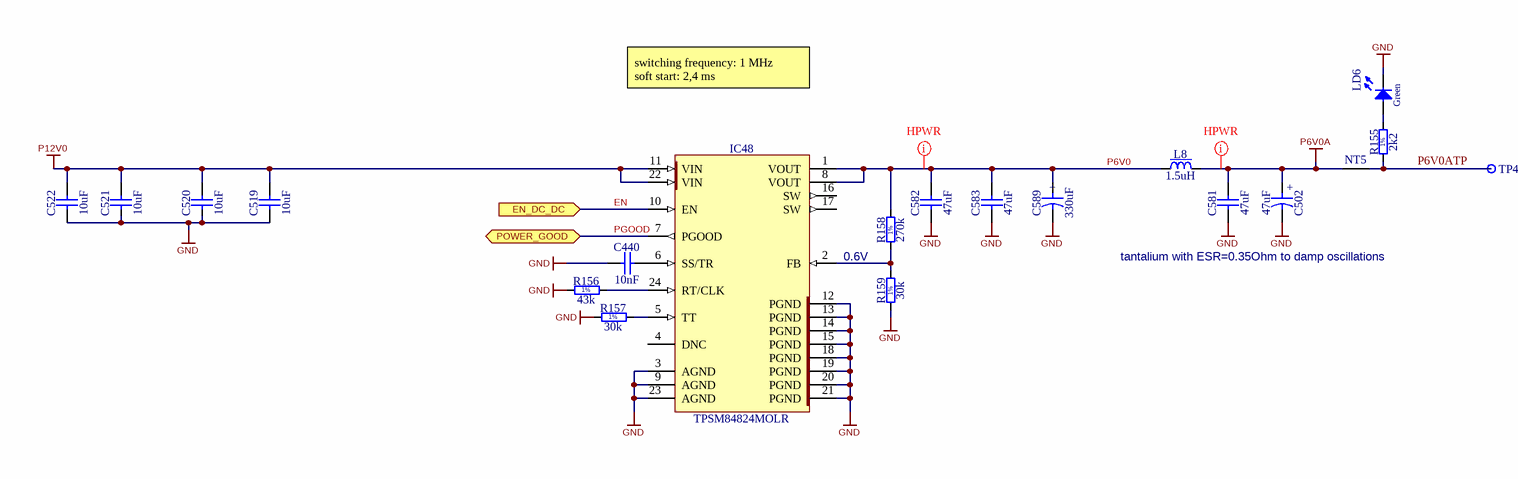
[diagram p7: PWR_Buck_6V_8A.SchDoc]

### Parts
C440  10nF  [CAPC1005X55N]
C502  47uF  [CAPMP6032X280N]
C519  10uF  [CAPC2012X95N]
C520  10uF  [CAPC2012X95N]
C521  10uF  [CAPC2012X95N]
C522  10uF  [CAPC2012X95N]
C581  47uF  [CAPC3225X270N]
C582  47uF  [CAPC3225X270N]
C583  47uF  [CAPC3225X270N]
C589  330uF  [CAPMP7343X310N]
IC48  TPSM84824MOLR  [TEXAS_QFM (MOL)]
L8  1.5uH  [IND_TDK_SPM6530]
LD6  Green  [LED_KINGBRIGHT_KPH-1608CGCK]
NT5  Net Tie  [Net Tie]  (value not drawn)  (net tie, no BOM)
R155  2k2  [RESC1005X40N]
R156  43k  [RESC1005X40N]
R157  30k  [RESC1005X40N]
R158  270k  [RESC1005X40N]
R159  30k  [RESC1005X40N]
TP48  Test Point  [TPS127]  (value not drawn)

### Ports
EN_DC_DC (in), POWER_GOOD (bidir)

### Nets
GND: C440.1 C502.2 C519.1 C520.1 C521.1 C522.1 C581.1 C582.1 C583.1 C589.2 IC48.3(AGND) IC48.9(AGND) IC48.12(PGND) IC48.13(PGND) IC48.14(PGND) IC48.15(PGND) IC48.18(PGND) IC48.19(PGND) IC48.20(PGND) IC48.21(PGND) IC48.23(AGND) LD6.1(C) R156.1 R157.1 R159.1
P6V0A: C502.1 C581.2 L8.2 NT5.1
P12V0: C519.2 C520.2 C521.2 C522.2 IC48.11(VIN) IC48.22(VIN)
EN: IC48.10(EN) ; port EN_DC_DC
P6V0: C582.2 C583.2 C589.1 IC48.1(VOUT) IC48.8(VOUT) L8.1 R158.2
P6V0ATP: NT5.2 R155.1 TP48.1
PGOOD: IC48.7(PGOOD) ; port POWER_GOOD
NetC440_2: C440.2 IC48.6(SS/TR)
NetIC48_2: IC48.2(FB) R158.1 R159.2
NetIC48_5: IC48.5(TT) R157.2
NetIC48_24: IC48.24(RT/CLK) R156.2
NetLD6_2: LD6.2(A) R155.2

Not connected (* = marked no-connect by the designer): IC48 4(DNC) 16(SW) 17(SW)

### Layout directives
net class HPWR: P6V0, P6V0A

### Notes on the sheet
- switching frequency: 1 MHz
  soft start: 2,4 ms
- 0.6V
- tantalium with ESR=0.35Ohm to damp oscillations
- Project/Equipment
- Document
- Designer
- Drawn by
- Check.by
- Copyright WUT ISE 2018.
  This documentation describes Open Hardware and is licensed under the CERN OHL v.1.1. You may redistribute and modify this documentation under the terms of the CERN OHL v.1.1. (http://ohwr.org/CERNOHL). This documentation is distributed WITHOUT ANY EXPRESS OR IMPLIED WARRANTY, INCLUDING OF MERCHANTABILITY, SATISFACTORY QUALITY AND FITNESS FOR A PARTICULAR PURPOSE. Please see the CERN OHL v.1.1 for applicable conditions.
- Contact
- File
- Last Mod.
- Print Date
- Sheet
- Size
- A3
- of
- Rev
- (in symbol CTE6032-28_47UF_16V_10%_LESR0350) +
- (in symbol CTE7343-31_330UF_6.3V_20%_LESR0015_KEMET_T520) +
- (in symbol R0402_2K2_1%_0.0625W_100PPM) 1%
- (in symbol R0402_30K_1%_0.0625W_100PPM) 1%
- (in symbol R0402_30k_1%_0.0625W_100PPM) 1%
- (in symbol R0402_43K_1%_0.0625W_100PPM) 1%
- (in symbol R0402_270K_1%_0.0625W_100PPM) 1%

### Library data of the parts
C440 = CC0402_10NF_16V_10%_X7R: Non-polarised capacitor; Manufacturer: GENERIC; Manufacturer1 Part Number: 223878715636; Part Description: SMD Multilayer Chip Ceramic Capacitor; TC: X7R; Tolerance: ±10%; Voltage: 16V; Case: 0402; Manufacturer Part Number: CC0402_10NF_16V_10%_X7R; Manufacturer1 Example: PHYCOMP; Part Number: CC0402_10NF_16V_10%_X7R; Pin Count: 2; SMD: Yes; Status: Not Recommended; Value: 10nF; Component Kind: Standard; Component Type: Standard; Mounted: Yes; Socket: No; Sense: No; Manufacturer1 ComponentHeight: 0.55mm; HelpURL: \\cern.ch\dfs\Applications\Altium\Datasheets\CC0402_X7R_PHYCOMP.pdf; Author: CERN DEM JLC; CreateDate: 03.12.2007; LatestRevisionDate: 03.12.2007
C502 = CTE6032-28_47UF_16V_10%_LESR0350: as C488 on sheet DAC_JESD204B; Case: C; Manufacturer Part Number: CTE6032-28_47UF_16V_10%_LESR0350; Manufacturer1 Example: AVX; Part Number: CTE6032-28_47UF_16V_10%_LESR0350; Pin Count: 2; SMD: Yes; Value: 47uF; Component Kind: Standard; Component Type: Standard; Status: Preferred; Mounted: Yes; Socket: No; Sense: No; Manufacturer1 ComponentHeight: 2.8mm; HelpURL: \\cern.ch\dfs\Applications\Altium\Datasheets\CTE-LESR_AVX_TPS.pdf; Author: CERN DEM JLC; CreateDate: 05.05.2008; LatestRevisionDate: 20.01.2009
C519-C522 = CC0805_10UF_25V_10%_X5R: as C539 on sheet PWR_SEPIC_N6V; Case: 0805; Manufacturer Part Number: CC0805_10UF_25V_10%_X5R; Manufacturer1 Example: MURATA; Part Number: CC0805_10UF_25V_10%_X5R; Pin Count: 2; SMD: Yes; Status: Preferred; Value: 10uF; Component Kind: Standard; Component Type: Standard; Mounted: Yes; Socket: No; Sense: No; Manufacturer1 ComponentHeight: 0.95mm; HelpURL: \\cern.ch\dfs\Applications\Altium\Datasheets\CC0805_X5R_MURATA_GRM.pdf; Author: CERN DEM JLC; CreateDate: 25.10.2012; LatestRevisionDate: 06.09.2016
C581-C583 = CC1210_47UF_10V_10%_X7R: as C584 on sheet PWR_SEPIC_N6V; Case: 1210; Manufacturer Part Number: CC1210_47UF_10V_10%_X7R; Manufacturer1 Example: MURATA; Part Number: CC1210_47UF_10V_10%_X7R; Pin Count: 2; SMD: Yes; Status: None; Value: 47uF; Component Kind: Standard; Component Type: Standard; Mounted: Yes; Socket: No; Sense: No; Manufacturer1 ComponentHeight: 2.7mm; HelpURL: \\cern.ch\dfs\Applications\Altium\Datasheets\CC1210_X7R_MURATA.pdf; Author: CERN DEM BC; CreateDate: 18.11.2015; LatestRevisionDate: 18.11.2015
C589 = CTE7343-31_330UF_6.3V_20%_LESR0015_KEMET_T520: Polarised capacitor; Manufacturer Part Number: T520D337M006ATE015; Manufacturer: KEMET; Part Description: Low ESR 0R015 Tantalum Chip Capacitor; Tolerance: ±20%; Voltage: 6.3V; Case: D; ComponentHeight: 3.1mm; Part Number: CTE7343-31_330UF_6.3V_20%_LESR0015_KEMET_T520; Pin Count: 2; SMD: Yes; Status: None; Value: 330uF; Component Kind: Standard; Component Type: Standard; Mounted: Yes; Socket: No; Sense: No; HelpURL: \\cern.ch\dfs\Applications\Altium\Datasheets\CTE-LESR_KEMET_T520.pdf; Author: CERN DEM JLC; CreateDate: 11.01.2012; LatestRevisionDate: 11.01.2012
IC48 = TPSM84824MOLR: 4.5V to 17V Input, 0.6V to 10V Output, 8A Power Module; Manufacturer: TEXAS INSTRUMENTS; Bonding: No; PressFit: No; Status Comment: Solder Paste Deposition Limitation; Author: CERN DEM JLC; Case: QFN; Component Kind: Standard; Component Type: Standard; ComponentHeight: 5.4mm; CreateDate: 27.09.2018; Device: TPSM84824MOLR; HelpURL: \\cern.ch\dfs\Applications\Altium\Datasheets\TPSM84824MOLR.pdf; LatestRevisionDate: 27.09.2018; Manufacturer Part Number: TPSM84824MOLR; Mounted: Yes; PackageDescription: TEXAS QFM (MOL) Case; Part Description: 4.5V to 17V Input, 0.6V to 10V Output, 8A Power Module; Part Number: TPSM84824MOLR; Pin Count: 24; Sense: No; SMD: Yes; Socket: No; Status: Not Recommended
L8 = IND_1.5UH_20%_TDK_SPM6530: as L25 on sheet PWR_SEPIC_N6V; ComponentHeight: 3mm; Part Number: IND_1.5UH_20%_TDK_SPM6530; Pin Count: 2; SMD: Yes; Value: 1.5uH; Component Kind: Standard; Component Type: Standard; Status: None; Mounted: Yes; Socket: No; Sense: No; HelpURL: \\cern.ch\dfs\Applications\Altium\Datasheets\IND_TDK_SPM6530.pdf; Author: CERN DEM MR; CreateDate: 08.11.2016; LatestRevisionDate: 08.11.2016
LD6 = LED_KINGBRIGHT_KPH-1608CGCK: as LD9 on sheet PWR_SEPIC_N6V; Author: CERN DEM JLC; Color: Green; Component Kind: Standard; Component Type: Standard; ComponentHeight: 0.65mm; CreateDate: 03.07.2017; HelpURL: \\cern.ch\dfs\Applications\Altium\Datasheets\LED_KINGBRIGHT_KPH-1608CGCK.pdf; LatestRevisionDate: 03.07.2017; Manufacturer Part Number: KPH-1608CGCK; Manufacturer: KINGBRIGHT; Mounted: Yes; PackageDescription: SMT Green LED, Case 0603, Body L 1.6 x W 0.8mm H 0.65mm; Part Number: LED_KINGBRIGHT_KPH-1608CGCK; Pin Count: 2; Sense: No; SMD: Yes; Socket: No
NT5 = Net Tie: as NT18 on sheet PWR_SEPIC_N6V; Part Number: Net Tie; Component Type: Net Tie; Pin Count: 2; Family: Net Tie; Socket: No; SMD: No; Sense: No; Status: None; ComponentHeight: 0mm; HelpURL: Undefined; Author: CERN DEM JLC; CreateDate: 22.03.2011; LatestRevisionDate: 22.03.2011; PackageDescription: 2 Plated Through Hole For Coaxial Cable Link: Hole Dia.=1.4mm Pad Dia.=2.5mm
R155 = R0402_2K2_1%_0.0625W_100PPM: as R151 on sheet PWR_Buck_2V_4V_4A; Case: 0402; Manufacturer Part Number: R0402_2K2_1%_0.0625W_100PPM; Manufacturer1 ComponentHeight: 0.4mm; Manufacturer1 Example: YAGEO PHYCOMP; Part Number: R0402_2K2_1%_0.0625W_100PPM; Pin Count: 2; Power: 0.0625W; Sense: No; SMD: Yes; Status: Not Recommended; Tolerance: ±1%; Value: 2k2; Component Kind: Standard; Component Type: Standard; Mounted: Yes; Socket: No; HelpURL: \\cern.ch\dfs\Applications\Altium\Datasheets\R0402_Phycomp_RC0402.pdf; Author: CERN DEM JLC; CreateDate: 03.12.2007; LatestRevisionDate: 17.10.2012
R156 = R0402_43K_1%_0.0625W_100PPM: Resistor - 1%; Manufacturer: GENERIC; Manufacturer1 Part Number: 232270674303L; Part Description: General Purpose Thick Film Chip Resistor; TC: ±100ppm/°C; PressFit: No; Case: 0402; Manufacturer Part Number: R0402_43K_1%_0.0625W_100PPM; Manufacturer1 ComponentHeight: 0.4mm; Manufacturer1 Example: YAGEO PHYCOMP; Part Number: R0402_43K_1%_0.0625W_100PPM; Pin Count: 2; Power: 0.0625W; Sense: No; SMD: Yes; Status: Not Recommended; Tolerance: ±1%; Value: 43k; Component Kind: Standard; Component Type: Standard; Mounted: Yes; Socket: No; HelpURL: \\cern.ch\dfs\Applications\Altium\Datasheets\R0402_Phycomp_RC0402.pdf; Author: CERN DEM JLC; CreateDate: 2007-12-03; LatestRevisionDate: 2012-10-17
R157 = R0402_30k_1%_0.0625W_100PPM: Resistor - 1%; Manufacturer: GENERIC; Manufacturer1 Part Number: 232270673003L; Part Description: General Purpose Thick Film Chip Resistor; TC: ±100ppm/°C; PressFit: No; Case: 0402; Manufacturer Part Number: R0402_30K_1%_0.0625W_100PPM; Manufacturer1 ComponentHeight: 0.4mm; Manufacturer1 Example: YAGEO PHYCOMP; Part Number: R0402_30K_1%_0.0625W_100PPM; Pin Count: 2; Power: 0.0625W; Sense: No; SMD: Yes; Status: Not Recommended; Tolerance: ±1%; Value: 30k; Component Kind: Standard; Component Type: Standard; Mounted: Yes; Socket: No; HelpURL: \\cern.ch\dfs\Applications\Altium\Datasheets\R0402_Phycomp_RC0402.pdf; Author: CERN DEM JLC; CreateDate: 03.12.2007; LatestRevisionDate: 17.10.2012
R158 = R0402_270K_1%_0.0625W_100PPM: Resistor - 1%; Manufacturer: GENERIC; Manufacturer1 Part Number: 232270672704L; Part Description: General Purpose Thick Film Chip Resistor; TC: ±100ppm/°C; PressFit: No; Case: 0402; Manufacturer Part Number: R0402_270K_1%_0.0625W_100PPM; Manufacturer1 ComponentHeight: 0.4mm; Manufacturer1 Example: YAGEO PHYCOMP; Part Number: R0402_270K_1%_0.0625W_100PPM; Pin Count: 2; Power: 0.0625W; Sense: No; SMD: Yes; Status: Not Recommended; Tolerance: ±1%; Value: 270k; Component Kind: Standard; Component Type: Standard; Mounted: Yes; Socket: No; HelpURL: \\cern.ch\dfs\Applications\Altium\Datasheets\R0402_Phycomp_RC0402.pdf; Author: CERN DEM JLC; CreateDate: 03.12.2007; LatestRevisionDate: 17.10.2012
R159 = R0402_30K_1%_0.0625W_100PPM: Resistor - 1%; Manufacturer: GENERIC; Manufacturer1 Part Number: 232270673003L; Part Description: General Purpose Thick Film Chip Resistor; TC: ±100ppm/°C; PressFit: No; Case: 0402; Manufacturer Part Number: R0402_30K_1%_0.0625W_100PPM; Manufacturer1 ComponentHeight: 0.4mm; Manufacturer1 Example: YAGEO PHYCOMP; Part Number: R0402_30K_1%_0.0625W_100PPM; Pin Count: 2; Power: 0.0625W; Sense: No; SMD: Yes; Status: Not Recommended; Tolerance: ±1%; Value: 30k; Component Kind: Standard; Component Type: Standard; Mounted: Yes; Socket: No; HelpURL: \\cern.ch\dfs\Applications\Altium\Datasheets\R0402_Phycomp_RC0402.pdf; Author: CERN DEM JLC; CreateDate: 03.12.2007; LatestRevisionDate: 17.10.2012
TP48 = SMD_PAD_1.27X1.27MM: as TP63 on sheet DAC_JESD204B; ComponentHeight: 0mm; Family: Test Point; Part Number: SMD_PAD_1.27X1.27MM; Pin Count: 1; Sense: No; SMD: Yes; Socket: No; Status: None; Component Kind: Standard (No BOM); Component Type: Standard (No BOM); HelpURL: Undefined; Author: CERN DEM JLC; CreateDate: 12.01.2008; LatestRevisionDate: 12.01.2008; PackageDescription: 1.27mm x 1.27mm PCB Copper Area (SMD Test Point)